# EAGLE schematic Testersche (EAGLE 9.5.1)
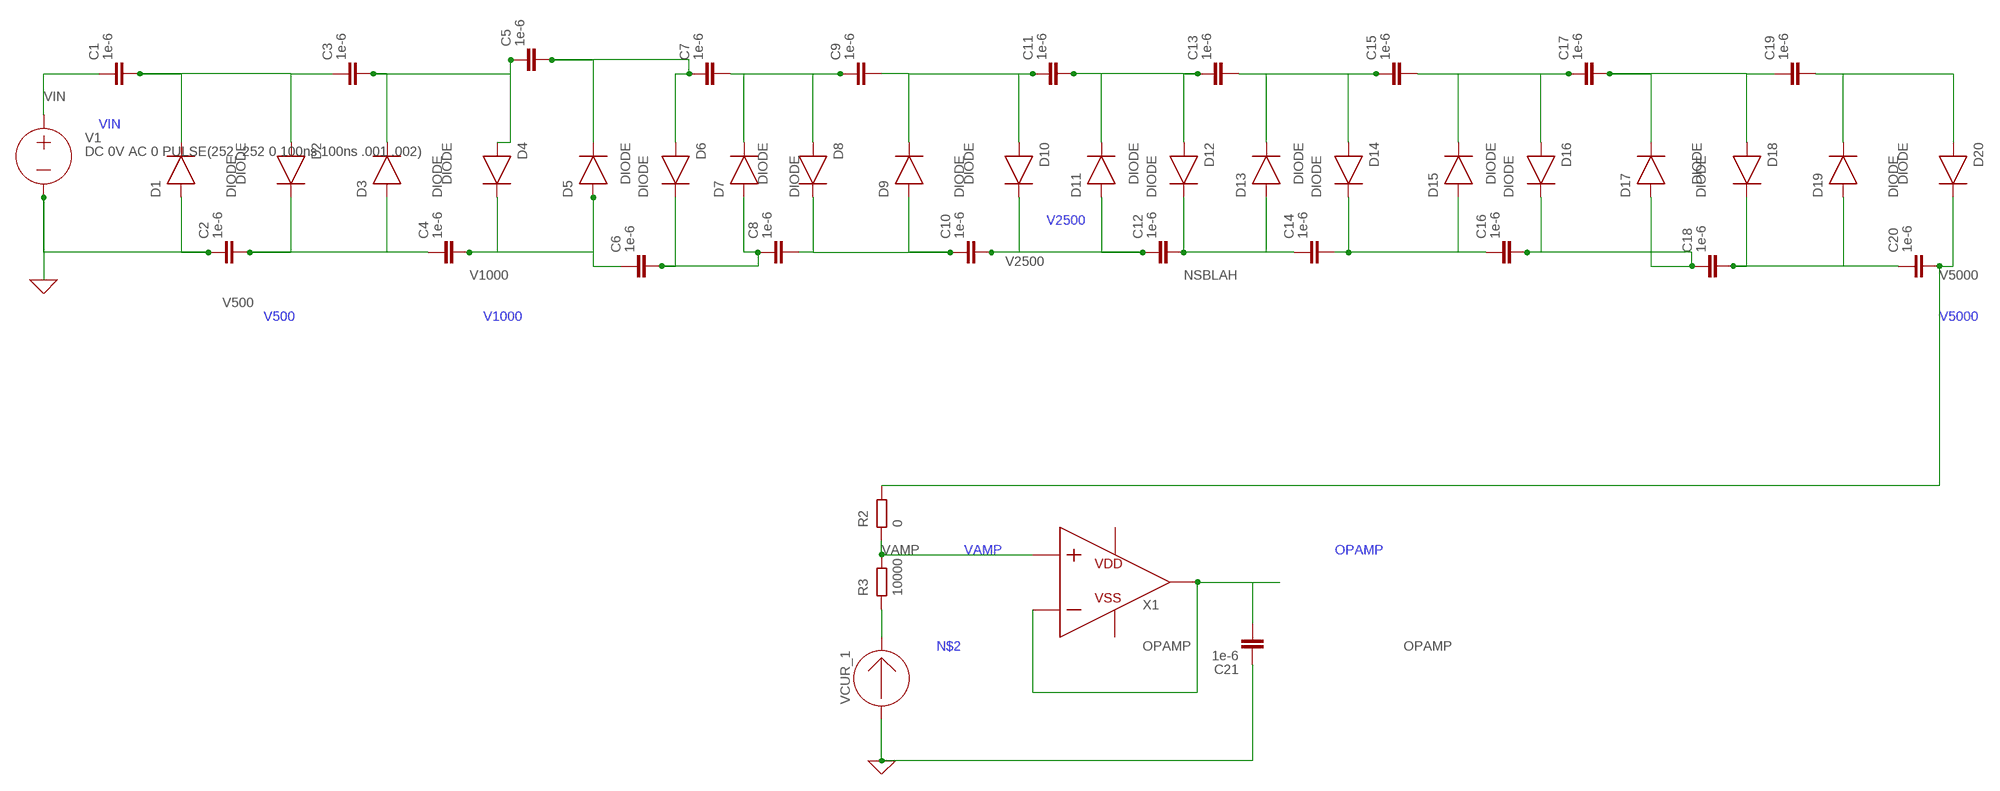
[diagram p0: schematic, sheet 1]

## Parts
C1  1e-6  C  (no package)
C2  1e-6  C  (no package)
C3  1e-6  C  (no package)
C4  1e-6  C  (no package)
C5  1e-6  C  (no package)
C6  1e-6  C  (no package)
C7  1e-6  C  (no package)
C8  1e-6  C  (no package)
C9  1e-6  C  (no package)
C10  1e-6  C  (no package)
C11  1e-6  C  (no package)
C12  1e-6  C  (no package)
C13  1e-6  C  (no package)
C14  1e-6  C  (no package)
C15  1e-6  C  (no package)
C16  1e-6  C  (no package)
C17  1e-6  C  (no package)
C18  1e-6  C  (no package)
C19  1e-6  C  (no package)
C20  1e-6  C  (no package)
C21  1e-6  C  (no package)
D1  DIODE  (no package)
D2  DIODE  (no package)
D3  DIODE  (no package)
D4  DIODE  (no package)
D5  DIODE  (no package)
D6  DIODE  (no package)
D7  DIODE  (no package)
D8  DIODE  (no package)
D9  DIODE  (no package)
D10  DIODE  (no package)
D11  DIODE  (no package)
D12  DIODE  (no package)
D13  DIODE  (no package)
D14  DIODE  (no package)
D15  DIODE  (no package)
D16  DIODE  (no package)
D17  DIODE  (no package)
D18  DIODE  (no package)
D19  DIODE  (no package)
D20  DIODE  (no package)
R2  0  R  (no package)
R3  10000  R  (no package)
V1  DC 0V AC 0 PULSE(252 -252 0 100ns 100ns .001 .002)  VOLTAGE  (no package)
VCUR_1  AMMETER  (no package)
X1  OPAMP  (no package)

## Nets
0: C2.1 C21.1 D1.A V1.- VCUR_1.+ ; supply symbol labelled GND
N$1: C1.2 C3.1 D1.C D2.A
N$2: R3.1 VCUR_1.-
N$4: C3.2 C5.1 D3.C D4.A
N$7: C6.2 C8.1 D6.C D7.A
N$8: C5.2 C7.1 D5.C D6.A
N$9: C7.2 C9.1 D7.C D8.A
N$10: C8.2 C10.1 D8.C D9.A
N$11: C9.2 C11.1 D9.C D10.A
N$16: C11.2 C13.1 D11.C D12.A
N$17: C13.2 C15.1 D13.C D14.A
N$18: C14.2 C16.1 D14.C D15.A
N$19: C15.2 C17.1 D15.C D16.A
N$22: C16.2 C18.1 D16.C D17.A
N$24: C17.2 C19.1 D17.C D18.A
N$25: C18.2 C20.1 D18.C D19.A
N$26: C19.2 D19.C D20.A
NSBLAH: C12.2 C14.1 D12.C D13.A
OPAMP: C21.2 X1.N X1.VOUT
V500: C2.2 C4.1 D2.C D3.A
V1000: C4.2 C6.1 D4.C D5.A
V2500: C10.2 C12.1 D10.C D11.A
V5000: C20.2 D20.C R2.2
VAMP: R2.1 R3.2 X1.P
VIN: C1.1 V1.+
Unconnected: X1.VDD X1.VSS

## Library data of the parts
C1-C21 = ngspice-simulation:C: CAPACITOR
D1-D20 = ngspice-simulation:DIODE: Diode
R2 R3 = ngspice-simulation:R: RESISTOR
V1 = ngspice-simulation:VOLTAGE: Independent Voltage Source, either DC, AC, PULSE, SINE, PWL, EXP, or SFFM; VALUE: 0V
VCUR_1 = ngspice-simulation:AMMETER: AMMETER
X1 = ngspice-simulation:OPAMP: Operational amplifier with power pins